# EAGLE design synth-zodiac-aries-vcf (EAGLE 9.6.2)
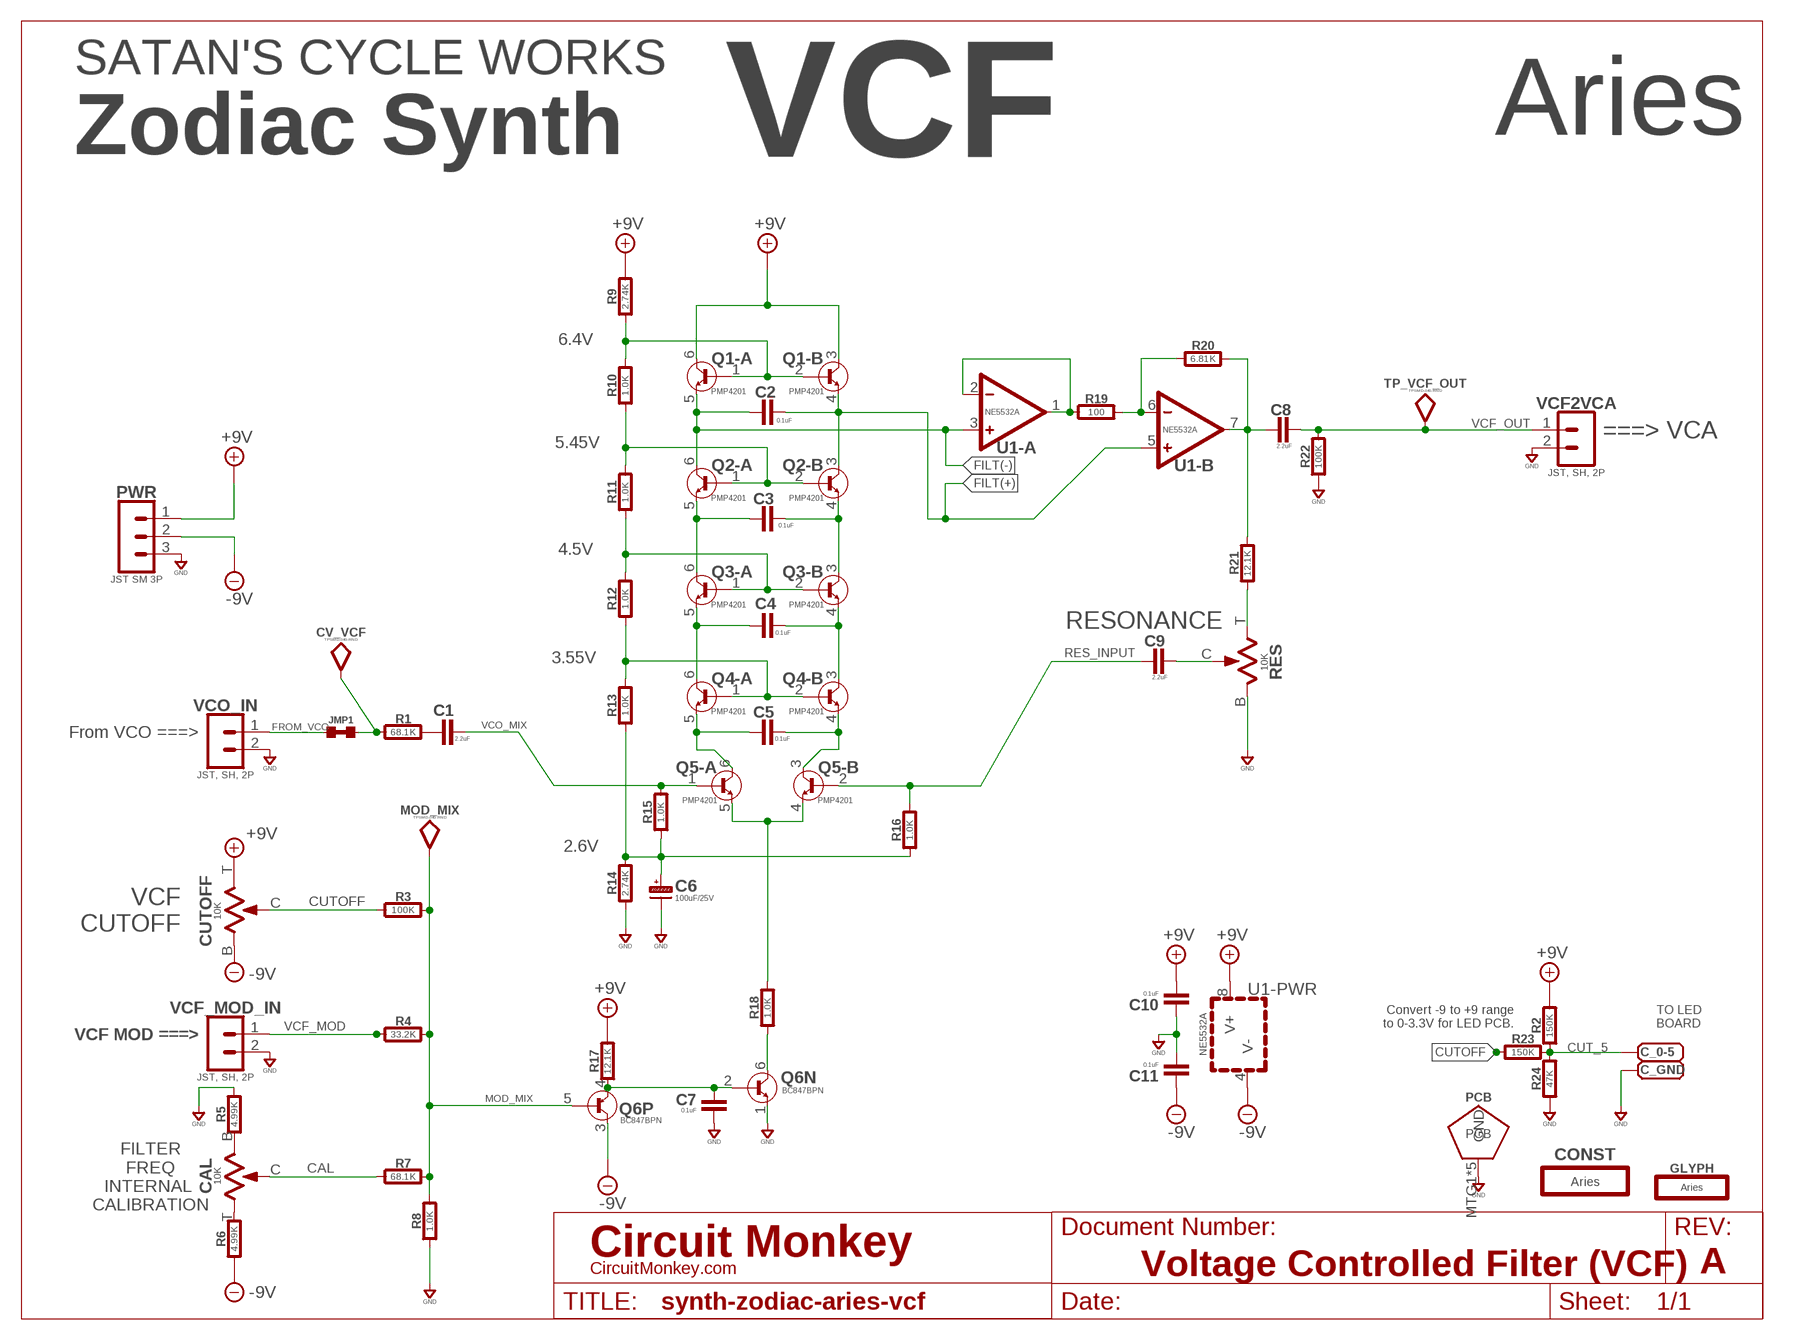
[diagram p0: schematic, sheet 1]
U$1 (LETTER_L-CIRCUITMONKEY): DOCUMENT_NUMBER: Voltage Controlled Filter (VCF); REV: A

## Parts
C1  2.2uF  CAPACITOR0603  [0603-CAP]
C2  0.1uF  CAPACITOR0603  [0603-CAP]
C3  0.1uF  CAPACITOR0603  [0603-CAP]
C4  0.1uF  CAPACITOR0603  [0603-CAP]
C5  0.1uF  CAPACITOR0603  [0603-CAP]
C6  100uF/25V  CAPACITOR_POL-ALUM-SMT-6.3  [CAP_ALUM_SMT_6.3]
C7  0.1uF  CAPACITOR0603  [0603-CAP]
C8  2.2uF  CAPACITOR0603  [0603-CAP]
C9  2.2uF  CAPACITOR0603  [0603-CAP]
C10  0.1uF  CAPACITOR0603  [0603-CAP]
C11  0.1uF  CAPACITOR0603  [0603-CAP]
C_0-5  PADSMD-070X070  [SMD-070MIL]
C_GND  PADSMD-070X070  [SMD-070MIL]
CAL  10K  TRIMPOTTC33X  [TRIM_BOURNS_TC33X]
CONST  Aries  CONSTELLATION-ARIES  [ARIES-CONST]
CUTOFF  10K  TRIMPOT9MM_PCB_SHAFT  [POT-RV9110]
CV_VCF  TPSMD-040-RND  [SMD-040MIL-RND]
GLYPH  Aries  GLYPH-ARIES  [ARIES-GLYPH]
JMP1  NP  SHORT0603  [0603-SHORT]
MOD_MIX  TPSMD-040-RND  [SMD-040MIL-RND]
PCB  PCB FAB  PENTAGON-40R  [PENTAGON-40MM-RAD]
PWR  JST SM 3P  03P-SM-VT-SMT  [BM03B-SRSS-TB]
Q1  PMP4201  NPN-DUALPMP4201  [SOT666]
Q2  PMP4201  NPN-DUALPMP4201  [SOT666]
Q3  PMP4201  NPN-DUALPMP4201  [SOT666]
Q4  PMP4201  NPN-DUALPMP4201  [SOT666]
Q5  PMP4201  NPN-DUALPMP4201  [SOT666]
Q6  BC847BPN  NPN-PNPBC847BPN  [SOT363]
R1  68.1K  RESISTOR0603  [0603-RES]
R2  150K  RESISTOR0603  [0603-RES]
R3  100K  RESISTOR0603  [0603-RES]
R4  33.2K  RESISTOR0603  [0603-RES]
R5  4.99K  RESISTOR0603  [0603-RES]
R6  4.99K  RESISTOR0603  [0603-RES]
R7  68.1K  RESISTOR0603  [0603-RES]
R8  1.0K  RESISTOR0603  [0603-RES]
R9  2.74K  RESISTOR0603  [0603-RES]
R10  1.0K  RESISTOR0603  [0603-RES]
R11  1.0K  RESISTOR0603  [0603-RES]
R12  1.0K  RESISTOR0603  [0603-RES]
R13  1.0K  RESISTOR0603  [0603-RES]
R14  2.74K  RESISTOR0603  [0603-RES]
R15  1.0K  RESISTOR0603  [0603-RES]
R16  1.0K  RESISTOR0603  [0603-RES]
R17  12.1K  RESISTOR0603  [0603-RES]
R18  1.0K  RESISTOR0603  [0603-RES]
R19  100  RESISTOR0603  [0603-RES]
R20  6.81K  RESISTOR0603  [0603-RES]
R21  12.1K  RESISTOR0603  [0603-RES]
R22  100K  RESISTOR0603  [0603-RES]
R23  150K  RESISTOR0603  [0603-RES]
R24  47K  RESISTOR0603  [0603-RES]
RES  10K  TRIMPOT9MM_PCB_SHAFT  [POT-RV9110]
TP_VCF_OUT  TPSMD-040-RND  [SMD-040MIL-RND]
U1  NE5532A  DUALNE5532-SMD  [SOP08]
VCF2VCA  JST, SH, 2P  02P-SM-VT-SMT  [BM02B-SRSS-TB]
VCF_MOD_IN  JST, SH, 2P  02P-SM-VT-SMT  [BM02B-SRSS-TB]
VCO_IN  JST, SH, 2P  02P-SM-VT-SMT  [BM02B-SRSS-TB]

## Nets
+9V: C10.2 CUTOFF.T PWR.1 Q1.3(-B:COLLECTOR) Q1.6(-A:COLLECTOR) R2.2 R9.2 R17.2 U1.8(-PWR:V+)
-9V: C11.1 CUTOFF.B PWR.2 Q6.3(P:COLLECTOR) R6.1 U1.4(-PWR:V-)
CAL: CAL.C R7.1
CUT_5: C_0-5.1(PAD) R2.1 R23.2 R24.2
CUTOFF: CUTOFF.C R3.1 R23.1
FILT(+): C2.2 Q1.4(-B:EMITTER) Q2.3(-B:COLLECTOR) U1.5(-B:+)
FILT(-): C2.1 Q1.5(-A:EMITTER) Q2.6(-A:COLLECTOR) U1.3(-A:+)
FROM_VCO: JMP1.3 VCO_IN.1
GND: C6.-(N) C7.2 C10.1 C11.2 C_GND.1(PAD) PCB.MTG1(GND) PCB.MTG2(GND) PCB.MTG3(GND) PCB.MTG4(GND) PCB.MTG5(GND) PWR.3 Q6.1(N:EMITTER) R5.2 R8.1 R14.1 R22.1 R24.1 RES.B VCF2VCA.2 VCF_MOD_IN.2 VCO_IN.2
MOD_MIX: MOD_MIX.TP Q6.5(P:BASE) R3.2 R4.2 R7.2 R8.2
N$32: R19.2 R20.1 U1.6(-B:-)
N$34: Q1.1(-A:BASE) Q1.2(-B:BASE) R9.1 R10.2
N$35: C3.1 Q2.5(-A:EMITTER) Q3.6(-A:COLLECTOR)
N$36: C3.2 Q2.4(-B:EMITTER) Q3.3(-B:COLLECTOR)
N$37: Q2.1(-A:BASE) Q2.2(-B:BASE) R10.1 R11.2
N$38: C4.1 Q3.5(-A:EMITTER) Q4.6(-A:COLLECTOR)
N$39: C4.2 Q3.4(-B:EMITTER) Q4.3(-B:COLLECTOR)
N$40: Q3.1(-A:BASE) Q3.2(-B:BASE) R11.1 R12.2
N$41: C5.1 Q4.5(-A:EMITTER) Q5.6(-A:COLLECTOR)
N$42: C5.2 Q4.4(-B:EMITTER) Q5.3(-B:COLLECTOR)
N$43: Q4.1(-A:BASE) Q4.2(-B:BASE) R12.1 R13.2
N$46: Q5.4(-B:EMITTER) Q5.5(-A:EMITTER) R18.2
N$47: Q6.6(N:COLLECTOR) R18.1
N$48: C6.+(P) R13.1 R14.2 R15.1 R16.1
N$49: C7.1 Q6.2(N:BASE) Q6.4(P:EMITTER) R17.1
N$52: CAL.T R6.2
N$53: CAL.B R5.1
N$55: C1.1 R1.2
N$56: R19.1 U1.1(-A:OUT) U1.2(-A:-)
N$57: C8.1 R20.2 R21.2 U1.7(-B:OUT)
N$58: R21.1 RES.T
N$59: C9.2 RES.C
RES_INPUT: C9.1 Q5.2(-B:BASE) R16.2
VCF_IN: CV_VCF.TP JMP1.4 R1.1
VCF_MOD: R4.1 VCF_MOD_IN.1
VCF_OUT: C8.2 R22.2 TP_VCF_OUT.TP VCF2VCA.1
VCO_MIX: C1.2 Q5.1(-A:BASE) R15.2

## Notes on the sheet
- VCF | Aries
- SATAN'S CYCLE WORKS
- Zodiac Synth
- 6.4V
- ===> VCA
- 5.45V
- 4.5V
- RESONANCE
- 3.55V
- From VCO ===>
- 2.6V
- VCF
  CUTOFF
- Convert -9 to +9 range
  to 0-3.3V for LED PCB.
- TO LED
  BOARD
- VCF MOD ===>
- FILTER
  FREQ
  INTERNAL 
  CALIBRATION

## Library data of the parts
C1-C5 C7-C11 = rlc:CAPACITOR: Capacitor; COST01: 0.12; COST10: 0.09; COST100: 0.05
C6 = rlc:CAPACITOR_POL: Polarized Capacitor; COST01: 0.5; COST10: 0.5; COST100: 0.4; MFR: Wurth; MPN: 865090445008
C_0-5 C_GND = con-testpoints:PAD: Solder Pad
CAL = rlc:TRIMPOT: Potentiometer; MFR: Bourns; MPN: TC33X
CONST = circuit-monkey-zodiac:CONSTELLATION: Constellations
CUTOFF RES = rlc:TRIMPOT: Potentiometer; COST01: 0.70; COST10: 0.60; COST100: 0.60; MFR: Tayda; MPN: RV9110NO-OS15A00; SKU: A-5517
CV_VCF MOD_MIX TP_VCF_OUT = con-testpoints:TP: Test Point -- Testpoint
GLYPH = circuit-monkey-zodiac:GLYPH: Glyph
JMP1 = rlc:SHORT: Pre-shorted SMT Resistor Pad
PCB = circuit-monkey-zodiac:PENTAGON: Pentagram shaped PCB
PWR = con-jst:03P: 3 pin connector; COST01: 0.60; COST10: 0.45; COST100: 0.38; MFR: JST; MPN: BM03B-SRSS-TB
Q1-Q5 = transistor-bjt:NPN-DUAL: Dual NPN Transistor; COST01: 0.55; COST10: 0.45; COST100: 0.35; MFR: NXP; MPN: PMP4201V
Q6 = transistor-bjt:NPN-PNP: NPN PNP pair; COST01: 0.25; COST10: 0.20; COST100: 0.10; MFR: PANJIT; MPN: BC487BPN
R1-R24 = rlc:RESISTOR: Resistor; COST01: 0.10; COST10: 0.05; COST100: 0.02
U1 = op-amp:DUAL: Dual Op-Amp; COST01: 0.65; COST10: 0.55; COST100: 0.40; MFR: TI; MPN: NE5532DR
VCF2VCA VCF_MOD_IN VCO_IN = con-jst:02P: 2 pin connector; COST01: 0.45; COST10: 0.4; COST100: 0.35; MFR: JST; MPN: BMB02B-SRSS-TB

## Board
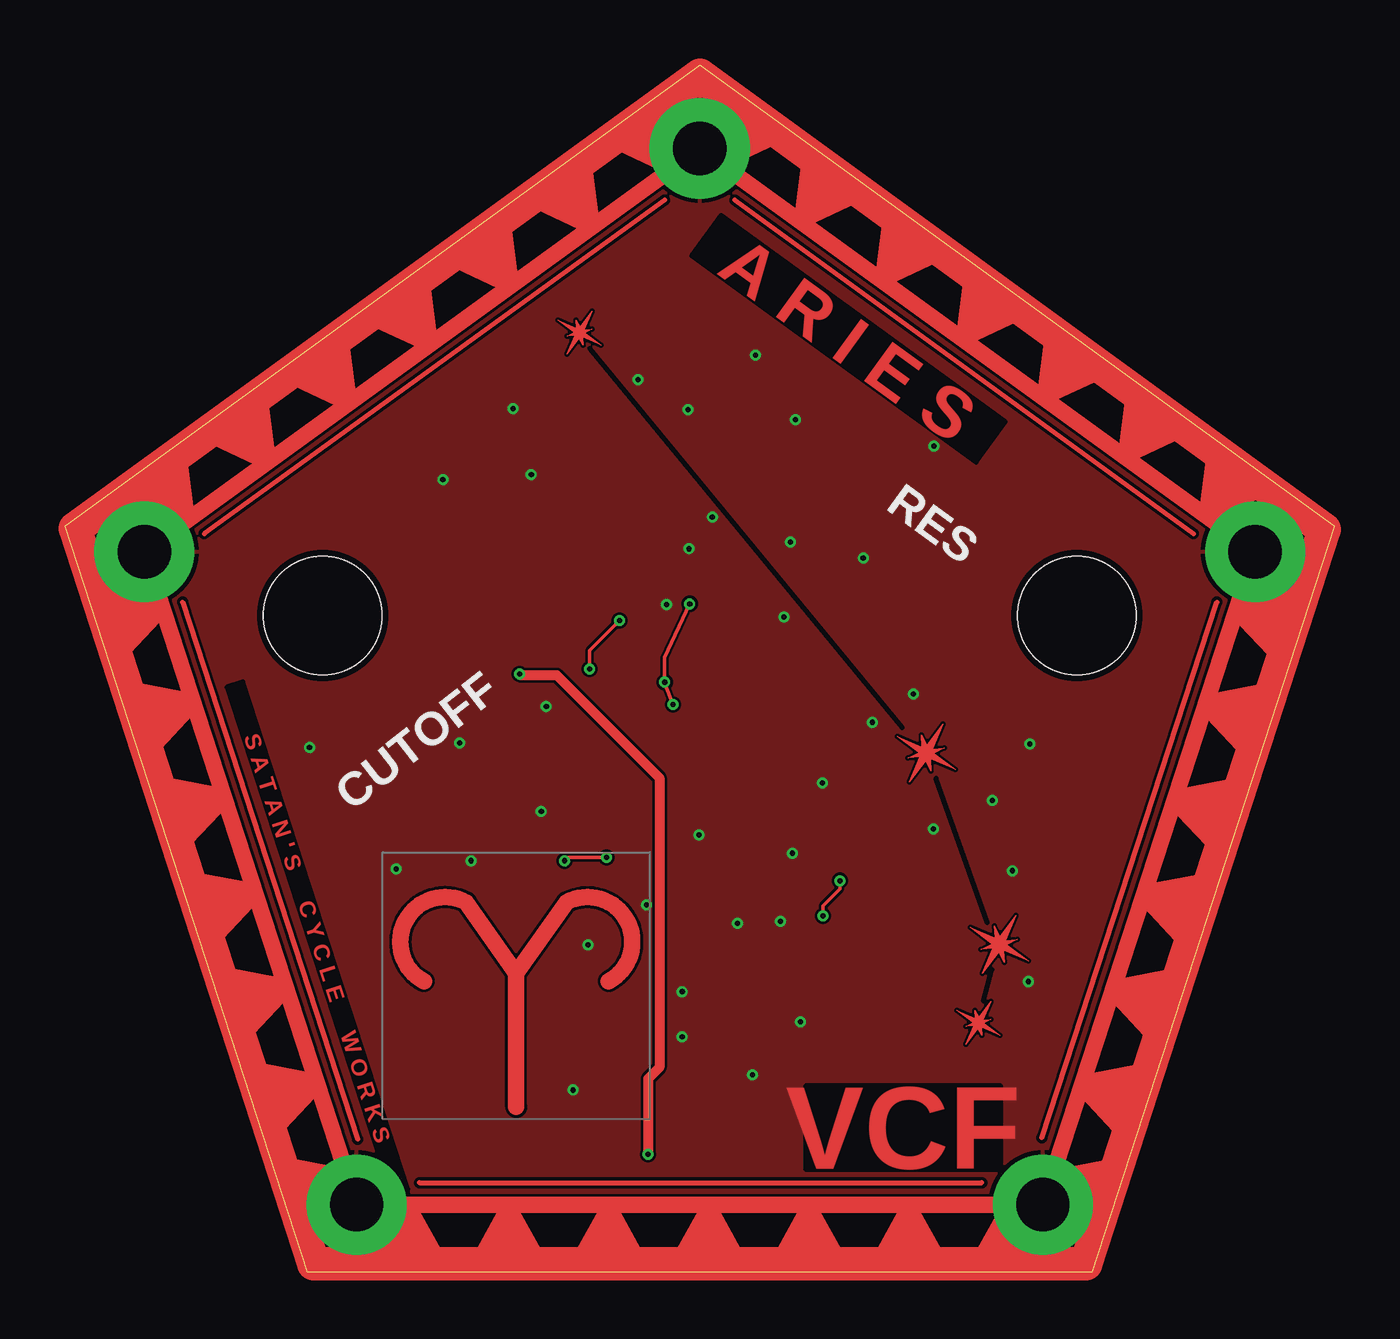
[diagram p1: board, top side]
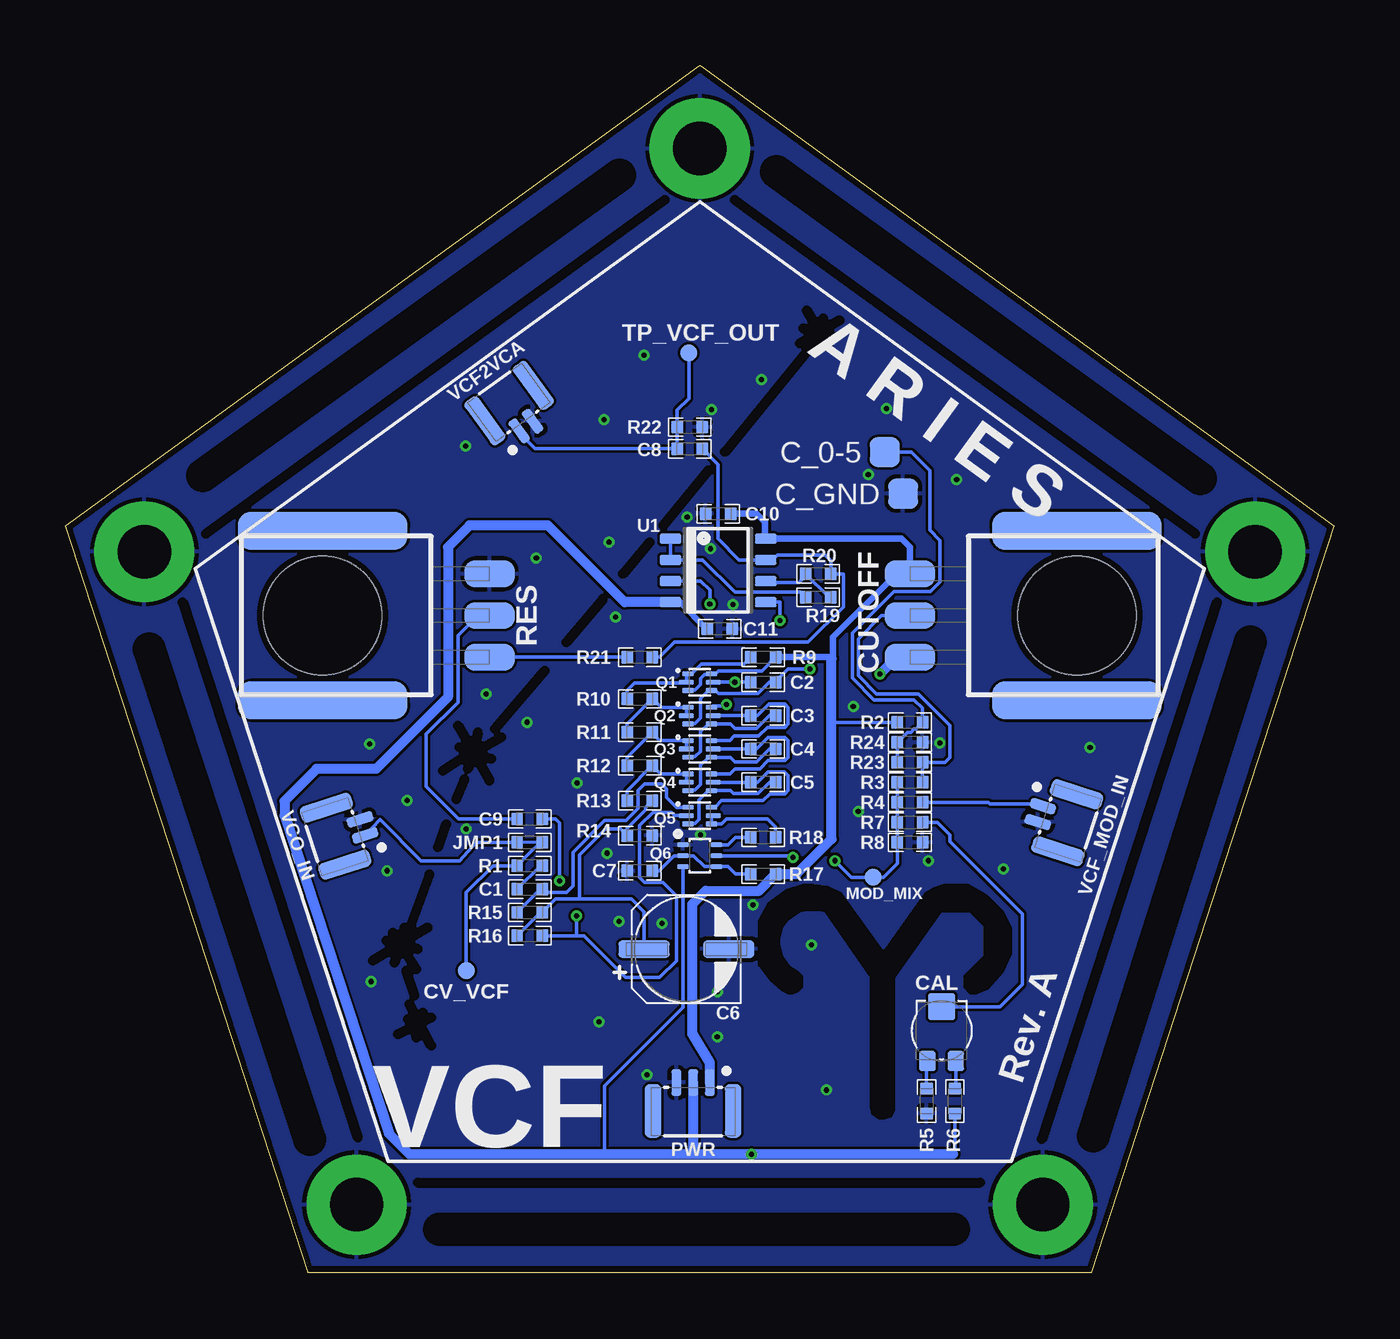
[diagram p2: board, bottom side, seen from below]

Size 76.08 x 72.36 mm. Coordinates in mm from the lower left corner, seen from the top.
Copper layers (1*16): Top 0.0356mm / dielectric 1.5011mm / Bottom 0.0356mm
Design rules "OSH-CircuitMonkey *": minimum track width 0.2mm, minimum drill 12mil, track to track 6mil, track to pad 6mil, pad to pad 6mil, via to via 6mil, smd to smd 6mil, copper to edge 15mil, drill to drill 6mil, minimum pad ring 7mil, minimum via ring 7mil, stop-mask expansion 3mil, vias tented up to drill 12mil, thermal gap 10mil
bRestrict: area 19.3,9.2 to 34.5,23.3; 26 lines

### Footprints (pad centres in the part's own frame; a part is rotated, then mirrored left to right if it is on the bottom)
0603-CAP = smd 0.711 x 0.762: 1 -0.752,0; 2 0.752,0
CAP_ALUM_SMT_6.3 = smd 3.048 x 1.016: + 2.54,0; - -2.54,0
SMD-070MIL = smd 1.778 x 1.778: 1 0.508,0
TRIM_BOURNS_TC33X = smd 1 x 1.2: B -0.85,-1.8; T 0.85,-1.8 | smd 1.6 x 1.6: C 0,1.45
POT-RV9110 = smd 1.6 x 3: B 2.5,-10; C 0,-10; T -2.5,-10 | smd 2.286 x 10.16: MNT1 -5.08,0; MNT2 5.08,0 | hole 7.1: 0,0
SMD-040MIL-RND = smd 1.016 x 1.016: TP 0,0
0603-SHORT = smd 0.711 x 0.762: 3 -0.752,0; 4 0.752,0
PENTAGON-40MM-RAD = drill 3.2 pad 6: MTG1 0,35; MTG2 33.3,10.82; MTG3 20.57,-28.32; MTG4 -20.57,-28.32; MTG5 -33.3,10.82
BM03B-SRSS-TB = smd 0.6 x 1.6: 1 -1,-0.3; 2 0,-0.3; 3 1,-0.3 | smd 1 x 3.2: MTG1 2.4,1.4; MTG2 -2.4,1.4
SOT666 = smd 0.32 x 0.7: 1 -0.5,-0.7; 3 0.5,-0.7; 4 0.5,0.7; 6 -0.5,0.7 | smd 0.32 x 0.9: 2 0,-0.8; 5 0,0.8
SOT363 = smd 0.3 x 0.7: 1 -0.65,-1; 2 0,-1; 3 0.65,-1; 4 0.65,1; 5 0,1; 6 -0.65,1
0603-RES = smd 0.711 x 0.762: 1 -0.752,0; 2 0.752,0
SOP08 = smd 0.6 x 1.3: 1 -1.905,-2.85; 2 -0.635,-2.85; 3 0.635,-2.85; 4 1.905,-2.85; 5 1.905,2.85; 6 0.635,2.85; 7 -0.635,2.85; 8 -1.905,2.85
BM02B-SRSS-TB = smd 0.6 x 1.6: 1 -0.5,-0.3; 2 0.5,-0.3 | smd 1 x 3.2: MTG1 1.8,1.4; MTG2 -1.8,1.4

### Placement (x,y rotation side)
C1  48.24,22.96 0 bottom
C2  34.24,35.36 0 bottom
C3  34.24,33.36 0 bottom
C4  34.24,31.36 0 bottom
C5  34.24,29.36 0 bottom
C6  38.84,19.36 180 bottom
C7  41.64,24.06 180 bottom
C8  38.64,49.36 180 bottom
C9  48.24,27.16 180 bottom
C10  36.94,45.46 0 bottom
C11  36.84,38.56 0 bottom
C_0-5  26.44,49.16 180 bottom
C_GND  25.34,46.66 180 bottom
CAL  23.54,14.46 0 bottom
CONST  43.04,32.26 60 top
CUTOFF  15.44,39.36 270 bottom
CV_VCF  52.04,18.06 0 bottom
GLYPH  27.04,17.16 0 top
JMP1  48.24,25.76 0 bottom
MOD_MIX  27.64,23.66 0 bottom
PCB  38.04,32.36 0 top
PWR  38.44,11.06 180 bottom
Q1  38.04,35.36 270 bottom
Q2  38.04,33.36 270 bottom
Q3  38.04,31.36 270 bottom
Q4  38.04,29.36 270 bottom
Q5  38.04,27.36 270 bottom
Q6  38.04,24.96 270 bottom
R1  48.24,24.36 0 bottom
R2  25.44,32.96 180 bottom
R3  25.44,29.36 180 bottom
R4  25.44,28.16 180 bottom
R5  24.44,10.26 270 bottom
R6  22.74,10.26 90 bottom
R7  25.44,26.96 180 bottom
R8  25.44,25.76 180 bottom
R9  34.24,36.86 0 bottom
R10  41.64,34.36 180 bottom
R11  41.64,32.36 180 bottom
R12  41.64,30.36 180 bottom
R13  41.64,28.26 180 bottom
R14  41.64,26.16 180 bottom
R15  48.24,21.56 180 bottom
R16  48.24,20.16 0 bottom
R17  34.24,23.86 0 bottom
R18  34.24,26.06 0 bottom
R19  30.94,40.46 0 bottom
R20  30.94,41.86 0 bottom
R21  41.64,36.86 0 bottom
R22  38.64,50.66 180 bottom
R23  25.44,30.56 180 bottom
R24  25.44,31.76 180 bottom
RES  60.64,39.36 90 bottom
TP_VCF_OUT  38.69,55.11 0 bottom
U1  36.94,42.06 270 bottom
VCF2VCA  48.64,50.96 36 bottom
VCF_MOD_IN  17.34,27.36 252 bottom
VCO_IN  58.54,26.56 108 bottom

### Tracks (layer width: path | path; a pad name or v marks a point on that pad's centre or on a via)
+9V
  Bottom 0.2: Q1.3 38.7,34.9 38.32,34.9 37.99,35.22 37.99,35.6 37.77,35.82 37.38,35.82 Q1.6 37.11,35.86 36.93,36.04 34.31,36.04 R9.2 | R2.2 30.14,32.96
  Bottom 0.4: R9.2 30.24,36.86 | 30.24,36.86 30.04,36.86 30.04,38.06 26.24,41.86 CUTOFF.T 25.44,43.46 25.95,43.97 U1.8 34.14,44.02 34.14,44.96 34.64,45.46 C10.2 | 30.14,36.76 30.24,36.86
  Bottom 0.6: 30.14,36.76 30.14,32.96 30.14,25.96 32.24,23.86 R17.2 34.49,22.86 37.69,22.86 38.49,22.06 38.49,14.26 37.44,12.52 PWR.1
-9V  (via drill 0.3)
  Top 0.6: v34.94,7.06 34.94,11.59 35.62,12.27 35.62,29.63 29.47,35.79 27.31,35.79 v27.24,35.86
  Bottom 0.2: Q6.3 39.04,15.86 43.74,11.16 43.74,7.06 | R6.1 22.74,7.16 22.84,7.06
  Bottom 0.4: C11.1 37.64,38.56 39.24,40.16 U1.4
  Bottom 0.6: 22.84,7.06 v34.94,7.06 38.44,7.06 | 38.44,7.06 43.74,7.06 55.44,7.06 56.68,8.29 62.94,27.36 62.94,28.23 61.02,30.16 57.44,30.16 53.14,34.46 53.14,43.46 51.84,44.76 47.14,44.76 42.54,40.16 U1.4 | PWR.2 38.44,7.06 | CUTOFF.B 26.24,36.86 v27.24,35.86
CAL
  Bottom 0.2: CAL.C 20.04,15.91 18.69,17.26 18.69,21.46 23.04,25.81 23.04,26.21 23.79,26.96 R7.1
CUT_5
  Bottom 0.2: R23.2 R24.2 25.59,32.36 25.39,32.36 25.19,32.56 25.09,32.56 R2.1 24.69,33.81 25.19,34.31 27.59,34.31 28.89,35.61 28.89,38.31 26.39,40.81 24.21,40.81 23.64,41.38 23.64,43.86 24.25,44.47 24.25,48.06 25.35,49.16 C_0-5.1
CUTOFF
  Bottom 0.2: CUTOFF.C 27.14,39.36 28.54,37.96 28.54,35.76 27.44,34.66 24.94,34.66 23.04,32.76 23.04,30.86 23.34,30.56 R23.1 R3.1
FILT(+)  (via drill 0.3)
  Top 0.2: v31.44,36.16 31.44,37.27 v33.24,39.07
  Bottom 0.2: Q2.3 38.7,32.9 38.32,32.9 37.99,33.22 37.99,34.4 37.53,34.86 Q1.4 37.11,34.86 36.93,34.68 34.56,34.68 33.88,35.36 C2.2 33.49,35.41 32.74,36.16 v31.44,36.16 | U1.5 33.23,40.16 33.24,40.15 v33.24,39.07
FILT(-)  (via drill 0.3)
  Top 0.2: v36.44,34.03 35.94,35.33 v35.94,35.36 35.94,36.83 v37.44,40.06
  Bottom 0.2: C2.1 v35.94,35.36 Q1.5 | v36.44,34.03 36.64,34.03 36.74,33.93 37.28,33.93 Q2.6 | v37.44,40.06 37.44,40.88 37.99,41.43 U1.3
FROM_VCO
  Bottom 0.2: JMP1.3 51.44,25.76 52.44,24.66 54.74,24.66 57.21,27.13 VCO_IN.1
GND  (via drill 0.3)
  other vias: 26.84,51.76 22.64,47.51 34.34,53.51 43.79,51.11 43.49,43.76 41.39,54.96 47.84,42.81 43.09,39.26 48.39,32.96 57.84,31.66 55.59,28.26 52.04,26.56 56.79,24.06 57.74,17.41 45.39,29.31 37.99,26.21 24.34,24.66 28.54,27.61 36.99,16.81 44.09,15.01 31.34,19.61 36.04,40.01 37.34,51.71 41.19,11.81 34.84,22.01 19.84,24.16 38.79,45.26 37.39,43.36 27.94,47.81 28.84,33.91 23.64,31.71 30.44,10.91 50.84,34.66 43.59,25.11 42.89,21.01 40.29,20.91 36.99,14.11 14.64,31.46 52.09,49.51
  pour Bottom: 61.67,0.06 14.44,0.06 0.02,44.74 37.97,72.38 76.07,44.74
  pour Top (rank 4): 17.44,3.86 58.64,3.86 71.54,43.16 38.04,67.56 4.64,43.26
MOD_MIX  (via drill 0.3)
  Top 0.2: v32.44,24.86 30.14,24.86 v29.94,24.66
  Bottom 0.2: R3.2 R4.2 R7.2 R8.2 26.19,24.51 27.04,23.66 MOD_MIX.TP 28.94,23.66 v29.94,24.66 | Q6.5 32.54,24.96 v32.44,24.86
N$32
  Bottom 0.2: U1.6 33.99,41.33 32.09,41.33 31.69,41.72 R20.1 30.29,40.46 R19.2
N$34
  Bottom 0.2: R9.1 35.39,36.46 37.94,36.46 38.54,35.86 Q1.1 38.84,35.76 Q1.2 38.88,35.32 41.95,35.32 42.39,34.88 R10.2
N$35
  Bottom 0.2: Q2.5 C3.1 34.59,33.36 33.89,34.06 32.94,34.06 32.74,33.86 32.74,32.86 32.94,32.66 33.98,32.66 34.51,32.13 35.98,32.13 36.24,31.86 Q3.6
N$36
  Bottom 0.2: Q3.3 38.7,30.9 38.32,30.9 37.99,31.22 37.99,32.4 37.53,32.86 Q2.4 36.21,32.86 35.93,32.58 34.66,32.58 33.88,33.36 C3.2
N$37
  Bottom 0.2: R11.2 42.39,32.86 R10.1 40.84,34.36 40.34,33.86 Q2.1 38.84,33.76 Q2.2
N$38
  Bottom 0.2: Q3.5 C4.1 34.64,31.36 33.94,32.06 32.94,32.06 32.74,31.86 32.74,30.86 32.94,30.66 33.94,30.66 34.44,30.16 35.94,30.16 36.24,29.86 Q4.6
N$39
  Bottom 0.2: Q4.3 38.7,28.9 38.32,28.9 37.99,29.22 37.99,30.4 37.53,30.86 Q3.4 36.21,30.86 35.93,30.58 34.66,30.58 33.88,31.36 C4.2
N$40
  Bottom 0.2: R12.2 42.39,30.86 R11.1 40.89,32.31 40.44,31.86 Q3.1 38.84,31.76 Q3.2
N$41
  Bottom 0.2: Q4.5 C5.1 34.59,29.36 33.96,29.99 32.97,29.99 32.74,29.76 32.74,28.86 32.94,28.66 33.84,28.66 34.24,28.26 36.74,28.26 37.14,27.86 Q5.6
N$42
  Bottom 0.2: Q5.3 38.7,26.9 38.32,26.9 38.09,27.12 38.09,28.3 37.53,28.86 Q4.4 36.21,28.86 36.03,28.68 34.56,28.68 33.88,29.36 C5.2
N$43
  Bottom 0.2: R13.2 42.39,28.86 R12.1 40.39,29.86 Q4.1 38.84,29.76 Q4.2
N$46
  Bottom 0.2: R18.2 33.49,26.68 33.98,27.16 36.44,27.16 36.74,26.86 Q5.4 37.34,27.26 Q5.5
N$47
  Bottom 0.2: Q6.6 36.34,25.61 35.89,26.06 R18.1
N$48
  Bottom 0.2: R13.1 41.29,27.86 41.29,27.71 42.39,26.61 R14.2 42.79,26.56 43.69,26.56 45.24,25.01 45.24,22.36 | R16.1 47.59,21.56 R15.1 46.69,22.36 45.24,22.36 | 45.24,22.36 42.14,22.36 41.38,21.6 C6.+
N$49
  Bottom 0.2: C7.1 40.47,24.06 39.57,24.96 Q6.2 38.41,24.96 37.76,24.31 Q6.4 36.34,24.31 35.89,23.86 R17.1
N$52
  Bottom 0.2: CAL.T 22.69,11.06 R6.2
N$53
  Bottom 0.2: R5.1 24.44,12.51 24.39,12.56 CAL.B
N$55
  Bottom 0.2: C1.1 47.59,24.36 R1.2
N$56
  Bottom 0.2: R19.1 32.01,40.77 35.94,40.77 37.86,42.7 U1.2 U1.1
N$57
  Bottom 0.2: R21.2 40.44,36.86 39.54,37.76 31.54,37.76 29.44,39.86 29.44,41.86 R20.2 30.19,42.66 30.53,43 33.39,43 33.69,42.7 U1.7
  Bottom 0.203: U1.7 35.68,42.7 36.94,43.96 36.94,48.41 C8.1
N$58
  Bottom 0.2: RES.T R21.1
N$59
  Bottom 0.2: RES.C 51.34,39.36 52.54,38.16 52.54,34.16 54.44,32.26 54.44,29.11 52.49,27.16 C9.2
RES_INPUT  (via drill 0.3)
  Top 0.2: v46.44,23.46 46.44,22.96 45.44,21.96 v45.44,21.36
  Bottom 0.2: Q5.2 39.54,27.36 39.74,27.56 40.84,27.56 41.64,26.76 41.64,23.66 41.34,23.36 40.24,23.36 39.44,22.56 39.44,18.66 40.45,17.66 42.49,17.66 44.99,20.16 R16.2 45.44,20.16 v45.44,21.36 | C9.1 46.69,27.16 46.44,26.91 v46.44,23.46
VCF_IN
  Bottom 0.2: CV_VCF.TP 52.04,22.76 50.44,24.36 R1.1 48.29,25.06 47.59,25.76 JMP1.4
VCF_MOD
  Bottom 0.2: R4.1 20.74,28.16 20.64,28.06 17.61,28.06 VCF_MOD_IN.1
VCF_OUT
  Bottom 0.2: TP_VCF_OUT.TP 38.69,52.36 39.39,51.66 R22.2 C8.2 47.93,49.36 48.87,50.31 VCF2VCA.1
VCO_MIX
  Bottom 0.2: Q5.1 39.44,27.86 40.04,28.46 40.04,28.96 40.34,29.26 41.34,29.26 41.74,28.86 41.74,27.8 42.48,27.06 43.74,27.06 45.64,25.16 45.64,23.16 46.04,22.76 47.64,22.76 | 47.64,22.76 47.79,22.76 R15.2 | C1.2 47.44,22.96 47.64,22.76

### Text on the board
Top: A R I E S | S A T A N ' S C Y C L E W O R K S | VCF
bPlace: A R I E S | Rev. A | VCF
tStop: A R I E S | S A T A N ' S C Y C L E W O R K S | VCF